# EAGLE design LB-w4-DOUBLE_AND_v03(rev4) (EAGLE 6.6.0)
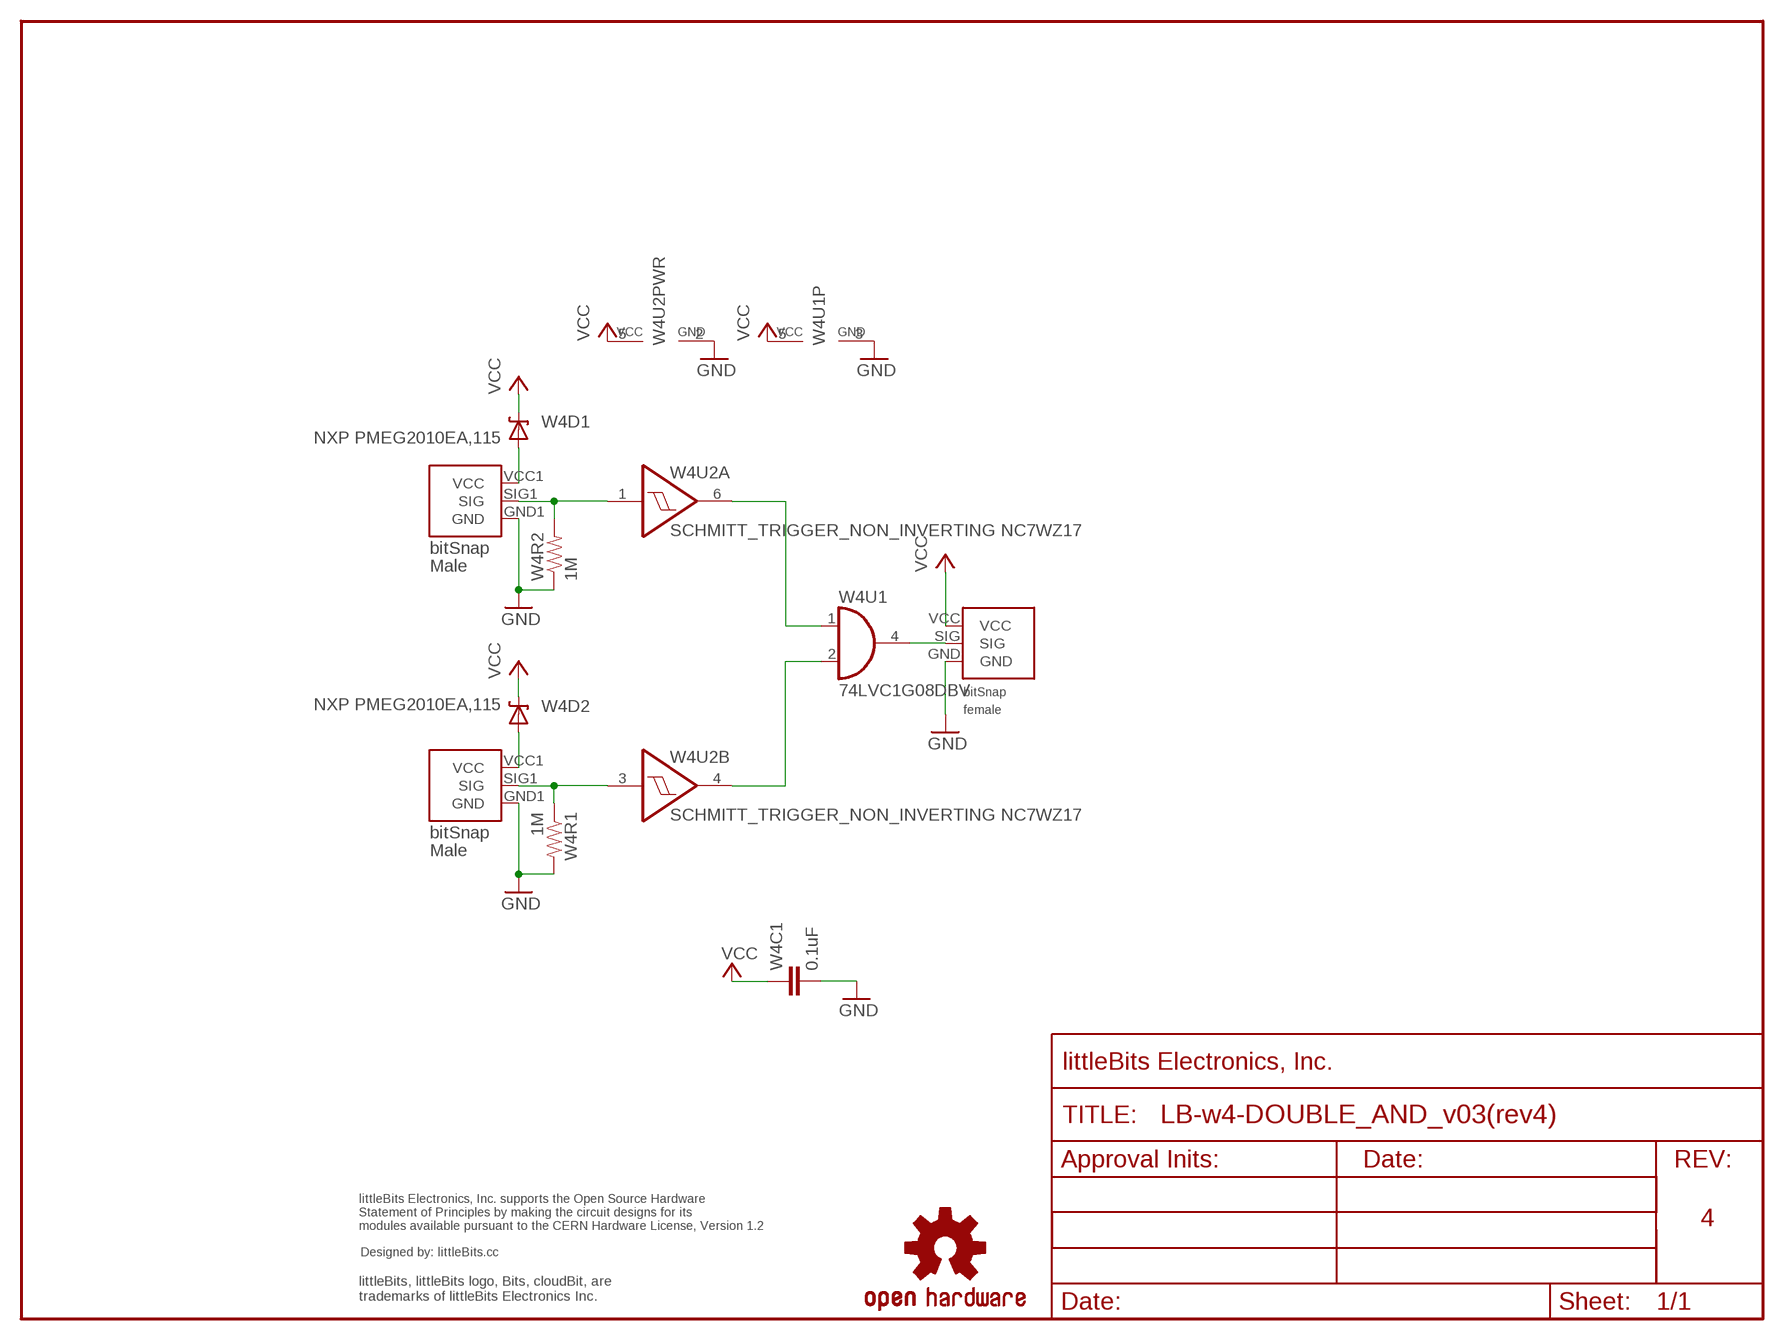
[diagram p0: schematic, sheet 1]

## Parts
FRAME1  FRAME-LETTER-OHWOHW  [FABDWG01-OHW]
U$1  OSHW-LOGOL  [OSHW-LOGO-L]
U$2  OSHWCREDIT  [OSHWCREDIT]
W4BSF1  BITSNAP_V03_FEMALE  [BITSNAP_V03_FEMALE]
W4BSM1  BITSNAP_V03_MALE  [BITSNAP_V03_MALE]
W4BSM2  BITSNAP_V03_MALE  [BITSNAP_V03_MALE]
W4C1  0.1uF  CAPCAP-0603  [CAP-0603]
W4D1  NXP PMEG2010EA,115  DIODE-ZENER-BZT52  [SOD-323]
W4D2  NXP PMEG2010EA,115  DIODE-ZENER-BZT52  [SOD-323]
W4R1  1M  RESISTOR0603-RES  [0603-RES]
W4R2  1M  RESISTOR0603-RES  [0603-RES]
W4U1  74LVC1G08DBV  [SOT23-5]
W4U2  SCHMITT_TRIGGER_NON_INVERTING NC7WZ17  SCHMITT_TRIGGER_NON_INVERTINGNC7WZ17  [SC70-6]

## Nets
GND: W4BSF1.GND W4BSM1.GND1(GND) W4BSM2.GND1(GND) W4C1.2 W4R1.2 W4R2.1 W4U1.3(GND) W4U2.2(PWR:GND)
N$1: W4BSF1.SIG W4U1.4(O)
N$2: W4BSM2.SIG1(SIG) W4R2.2 W4U2.1(A:I)
N$3: W4BSM1.VCC1(VCC) W4D2.2(A)
N$4: W4U1.1(I0) W4U2.6(A:O)
N$5: W4U1.2(I1) W4U2.4(B:O)
N$6: W4BSM2.VCC1(VCC) W4D1.2(A)
N$11: W4BSM1.SIG1(SIG) W4R1.1 W4U2.3(B:I)
VCC: W4BSF1.VCC W4C1.1 W4D1.1(C) W4D2.1(C) W4U1.5(VCC) W4U2.5(PWR:VCC)

## Notes on the sheet
- 4

## Library data of the parts
FRAME1 = LITTLEBITS:FRAME-LETTER-OHW
U$1 = SparkFun_NEW:OSHW-LOGO: Open Source Hardware Logo This logo indicates the piece of hardware it is found on incorporates a OSHW license and/or adheres to the definition of open source hardware found here: http://freedomdefined.org/OSHW
U$2 = LITTLEBITS:OSHWCREDIT
W4BSF1 = bitSnap:BITSNAP_V03_FEMALE
W4BSM1 W4BSM2 = bitSnap:BITSNAP_V03_MALE
W4C1 = LITTLEBITS:CAP
W4D1 W4D2 = SparkFun:DIODE-ZENER: Zener Diode Production Part - 8199 3.4V Zener Voltage
W4R1 W4R2 = SparkFun:RESISTOR: Resistor Basic schematic elements and footprints for 0603, 1206, and PTH 1/10th watt (small) resistors.
W4U1 = 74xx-little-de:74*1G08: 2-input AND gate
W4U2 = LITTLEBITS:SCHMITT_TRIGGER_NON_INVERTING

## Board
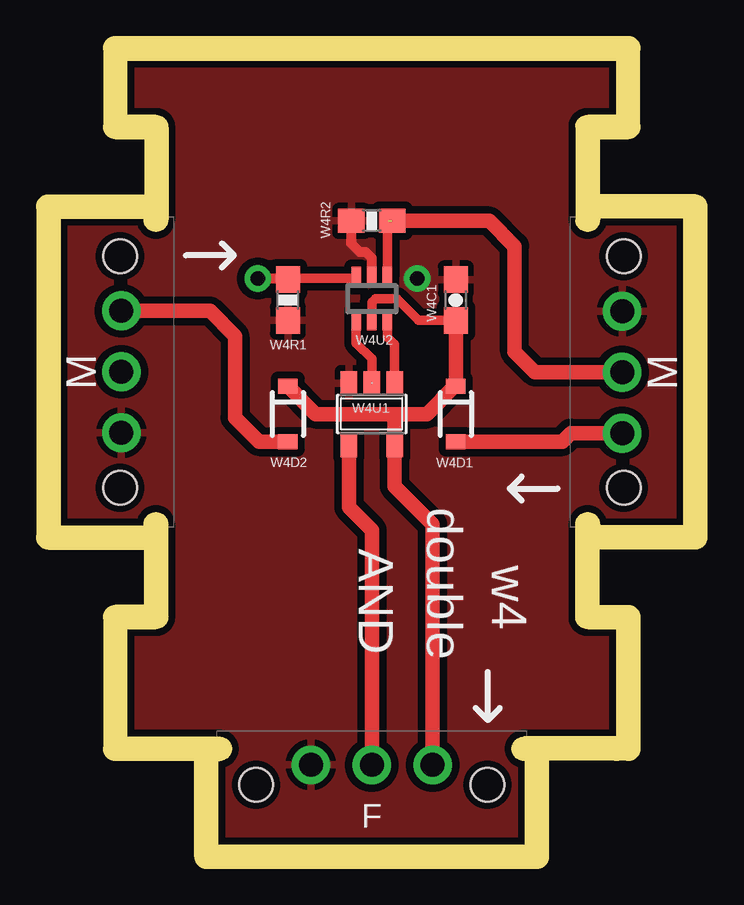
[diagram p1: board, top side]
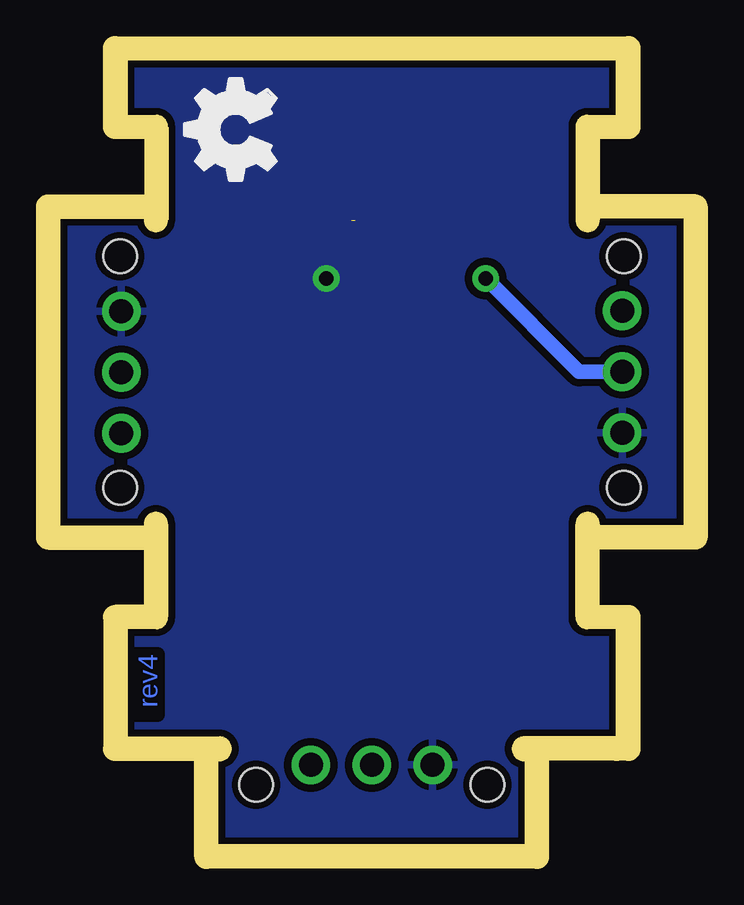
[diagram p2: board, bottom side, seen from below]

Size 26 x 32.7 mm. Coordinates in mm from the lower left corner, seen from the top.
Outline: 2.8,4.5 2.8,9 4,9 arc90 4.5,9.5 4.5,9.51
Outline: 23.2,4.5 23.2,9 22,9 arc-90 21.5,9.5 21.5,9.51
Outline: 4.5,29.9 arc90 4,30.4 2.8,30.4 2.8,32.7 23.2,32.7 23.2,30.4 22,30.4 arc90 21.5,29.9
Copper layers (1*16): Top 0.035mm / dielectric 1.5mm / Bottom 0.035mm
Design rules "default": minimum track width 8mil, minimum drill 20mil, track to track 8mil, track to pad 8mil, pad to pad 8mil, via to via 8mil, smd to smd 8mil, copper to edge 10mil, drill to drill 8mil, minimum pad ring 12mil, minimum via ring 10mil, stop-mask expansion 4mil, vias tented up to drill 25mil, thermal gap 10mil
Milling: 11 lines

### Footprints (pad centres in the part's own frame; a part is rotated, then mirrored left to right if it is on the bottom)
BITSNAP_V03_FEMALE = drill 1: GND 3.91,3.33; SIG 6.45,3.33; VCC 8.99,3.33 | hole 1.4: 1.63,2.5; 11.27,2.5
BITSNAP_V03_MALE = drill 1: GND1 8.98,2.56; SIG1 6.44,2.56; VCC1 3.9,2.56 | hole 1.4: 11.27,2.5; 1.63,2.5
CAP-0603 = smd 1.1 x 1: 1 -0.85,0; 2 0.85,0
SOD-323 = smd 0.63 x 0.83: 1 -1.15,0; 2 1.15,0
0603-RES = smd 1.1 x 1: 1 -0.85,0; 2 0.85,0
SOT23-5 = smd 0.69 x 0.99: 1 -0.95,-1.29; 2 0,-1.29; 3 0.95,-1.29; 4 0.95,1.3; 5 -0.95,1.3
SC70-6 = smd 0.4 x 0.85: 1 -0.65,-0.9; 2 0,-0.9; 3 0.65,-0.9; 4 0.65,0.9; 5 0,0.9; 6 -0.65,0.9

### Placement (x,y rotation side)
FRAME1  -2.23,0 0 top
U$1  -35.42,-70.46 0 top  (outside the outline)
U$2  -94.35,-66.1 0 top  (outside the outline)
U$3  [AND/OR_OVERLAY]  2.55,-3.05 0 top  (outside the outline)
U$15  [OSHW_FILLX150_NOTEXT]  17,26.85 0 top
W4BSF1  6.55,0 0 top
W4BSM1  0,26.15 270 top
W4BSM2  26,13.25 90 top
W4C1  16.5,22.7 90 top
W4D1  16.5,17.95 270 top
W4D2  9.5,17.95 270 top
W4R1  9.5,22.7 270 top
W4R2  13,26 0 top
W4U1  13,17.95 180 top
W4U2  13,22.76 180 top

### Tracks (layer width: path | path; a pad name or v marks a point on that pad's centre or on a via)
GND  (via drill 0.6)
  Top 0.406: W4U2.2 13,24.45 12.75,24.7 12.5,24.7 12.15,25.05 W4R2.1
  other vias: 14.9,23.6
  pour Top (isolate 0.305): 25.74,0.22 0.17,0.23 0.22,32.57 25.77,32.54
  pour Bottom (isolate 0.305): 0.22,32.57 25.77,32.54 25.74,0.22 0.17,0.23
N$1
  Top 0.61: W4U1.4 12.04,14.06 13,13.1 W4BSF1.SIG
N$2  (1 unrouted)
  Top 0.2: 21.18,19.72 21.15,19.69
  Top 0.4: 13.65,25.85 W4U2.1
  Top 0.6: W4BSM2.SIG1 21.15,19.69 19.81,19.69 18.95,20.55 18.95,24.95 17.9,26 13.7,26 13.65,25.85
N$3
  Top 0.6: W4BSM1.VCC1 6.25,22.25 7.3,21.2 7.3,17.8 8.3,16.8 W4D2.2
N$4
  Top 0.4: W4U2.6 13.65,21.15 13.95,20.85 W4U1.1
N$5
  Top 0.4: W4U2.4 12.35,20.9 13,20.25 W4U1.2
  Top 0.61: W4U1.2
N$6
  Top 0.6: W4D1.2 20.95,16.8 21.3,17.15 W4BSM2.VCC1
N$11  (via drill 0.6)
  Top 0.2: 12.34,23.6 W4U2.3
  Top 0.4: v8.25,23.6 12.34,23.6
  Top 0.406: v8.25,23.6 9.5,23.6 W4R1.1
  Bottom 0.6: W4BSM1.SIG1 4.36,19.71 v8.25,23.6
VCC
  Top 0.4: W4U2.5 13,22.6 13.15,22.75 14.05,22.75 14.95,21.85 W4C1.1
  Top 0.6: W4D2.1 10.65,17.95 13.95,17.95 | 13.95,17.95 15.3,17.95 16.45,19.1 W4D1.1 W4C1.1 | W4U1.5 13.95,17.95
  Top 0.61: W4U1.5 13.95,16.63 13.95,14.95 15.54,13.36 W4BSF1.VCC

### Text on the board
Bottom: rev4
tPlace: double | AND | w4
Milling: 1mm DIA. ROUTER PATH
Reference: LARGE
dxf: 4 | w4 DOUBLE AND BIT PCB